# EAGLE schematic rgbpi-sch (EAGLE 6.6.0)
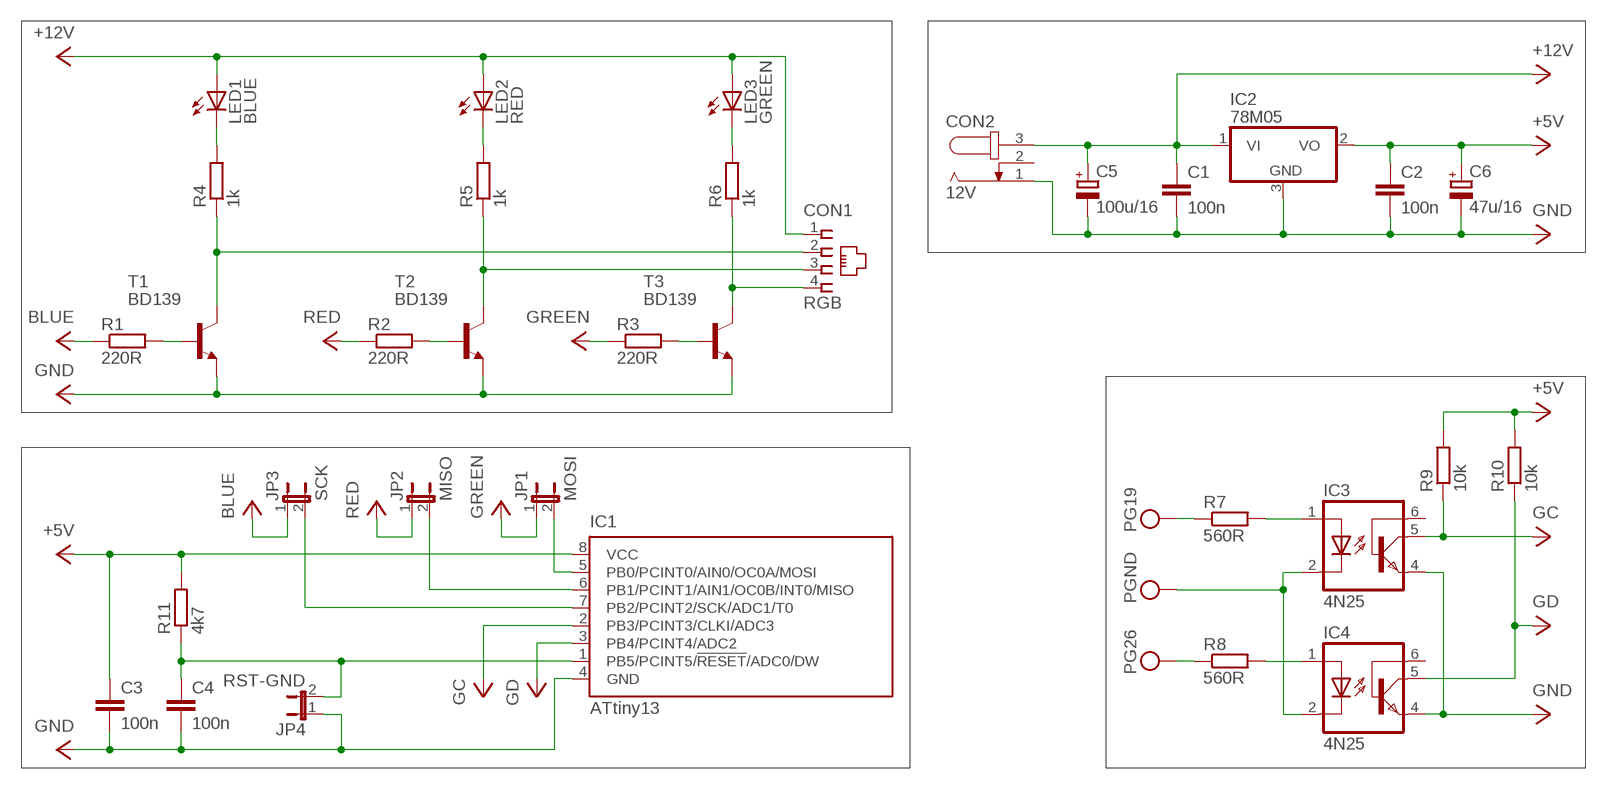
[diagram p0: schematic, sheet 1]

## Parts
C1  100n  C2,5-3  [C2.5-3]
C2  100n  C2,5-3  [C2.5-3]
C3  100n  C2,5-3  [C2.5-3]
C4  100n  C2,5-3  [C2.5-3]
C5  100u/16  CPOL-EU085CS-1AR  [085CS_1AR]
C6  47u/16  CPOL-EU085CS-1AR  [085CS_1AR]
CON1  RGB  215875-3  [215875-3]
CON2  12V  JACK-PLUG0  [SPC4077]
IC1  ATtiny13  TINY13-20SSU  [8S1]
IC2  78M05  7805DT  [TO252]
IC3  4N25  4N25M  [DIL06]
IC4  4N25  4N25M  [DIL06]
JP1  MOSI  JP1E  [JP1]
JP2  MISO  JP1E  [JP1]
JP3  SCK  JP1E  [JP1]
JP4  RST-GND  JP1E  [JP1]
LED1  BLUE  LAW57B  [W57B]
LED2  RED  LAW57B  [W57B]
LED3  GREEN  LAW57B  [W57B]
R1  220R  R  [R0805]
R2  220R  R  [R0805]
R3  220R  R  [R0805]
R4  1k  R  [R0805]
R5  1k  R  [R0805]
R6  1k  R  [R0805]
R7  560R  R  [R0805]
R8  560R  R  [R0805]
R9  10k  R  [R0805]
R10  10k  R  [R0805]
R11  4k7  R  [R0805]
T1  BD139  [TO126]
T2  BD139  [TO126]
T3  BD139  [TO126]

## Nets
N$1: R1.2 T1.3(B)
N$2: R2.2 T2.3(B)
N$3: R3.2 T3.3(B)
N$4: IC3.1(A) R7.2
N$5: CON1.4 R6.1 T3.2(C)
N$6: CON1.3 R5.1 T2.2(C)
N$7: CON1.2 R4.1 T1.2(C)
N$8: IC4.1(A) R8.2
N$9: LED3.C LED3.C@1(C) LED3.C@2(C) LED3.C@3(C) LED3.C@4(C) LED3.C@5(C) R6.2
N$10: LED2.C LED2.C@1(C) LED2.C@2(C) LED2.C@3(C) LED2.C@4(C) LED2.C@5(C) R5.2
N$11: LED1.C LED1.C@1(C) LED1.C@2(C) LED1.C@3(C) LED1.C@4(C) LED1.C@5(C) R4.2
N$12: C4.1 IC1.1(PB5/PCINT5/!RESET!/ADC0/DW) JP4.2 R11.1
N$13: IC1.5(PB0/PCINT0/AIN0/OC0A/MOSI) JP1.2
N$14: IC1.6(PB1/PCINT1/AIN1/OC0B/INT0/MISO) JP2.2
N$15: IC1.7(PB2/PCINT2/SCK/ADC1/T0) JP3.2
VCC: C1.1 C1.2 C2.1 C2.2 C3.1 C3.2 C4.2 C5.+ C5.- C6.+ C6.- CON1.1 CON2.1 CON2.3 IC1.2(PB3/PCINT3/CLKI/ADC3) IC1.3(PB4/PCINT4/ADC2) IC1.4(GND) IC1.8(VCC) IC2.1(VI) IC2.2(VO) IC2.3(GND) IC3.2(C) IC3.4(EMI) IC3.5(COL) IC4.2(C) IC4.4(EMI) IC4.5(COL) JP1.1 JP2.1 JP3.1 JP4.1 LED1.A LED2.A LED3.A R1.1 R2.1 R3.1 R7.1 R8.1 R9.1 R9.2 R10.1 R10.2 R11.2 T1.1(E) T2.1(E) T3.1(E) ; supply symbol labelled RED, GREEN, BLUE, +12V, GND, +5V, PG26, PG19, PGND, GD, GC
Unconnected: CON2.2 IC3.6(BAS) IC4.6(BAS)

## Library data of the parts
C1-C4 = capacitor-wima:C: CAPACITOR naming: grid - package width
C5 C6 = rcl:CPOL-EU: POLARIZED CAPACITOR, European symbol
CON1 = con-amp:215875-3: AMP connector
CON2 = con-jack:JACK-PLUG: DC POWER JACK Power Jack, DC, Right Angle, Through Hole, Rated 5A at 16VDC, PC Terminals Distributor: Farnell (www.Farnell.de) Drawing: 84N1161.pdf / 84N1162.pdf Manufacturer: SPC Technology (www.spctechnology.com) Type: SPC4077 / SPC 4078; OC_FARNELL: unknown; OC_NEWARK: unknown
IC1 = atmel:TINY13: 8-bit AVR Microcontroller with 1K Bytes In-System Programmable Flash Source: http://www.atmel.com/dyn/resources/prod_documents/2535S.pdf; MPN: ATTINY13-20SSU; OC_FARNELL: 1455133; OC_NEWARK: 58M3771
IC2 = linear:78*: Positive VOLTAGE REGULATOR Source: http://cache.national.com/ds/LM/LM78L05.pdf http://www.fairchildsemi.com/ds/LM/LM7805.pdf
IC3 IC4 = optocoupler:4N*?M: General Purpose 6-Pin Phototransistor Optocouplers Source: http://www.fairchildsemi.com/ds/4N/4N35-M.pdf; MPN: 4N25-M; OC_FARNELL: 1021349; OC_NEWARK: 98K9084
JP1-JP4 = jumper:JP1E: JUMPER
LED1-LED3 = led:*W57B: Golden Dragon® 1 Watt LED Place heat sink pads of cathode with INVOKE Source: www.osram-os.com la_ly_w57b.pdf
R1-R11 = eagle-ltspice:R: RESISTOR, European symbol; SPICEMODEL: NONE; SPICEPREFIX: R
T1-T3 = transistor:BD139: NPN TRANSISTOR